# Altium project Ninja_ECU.PrjPcb
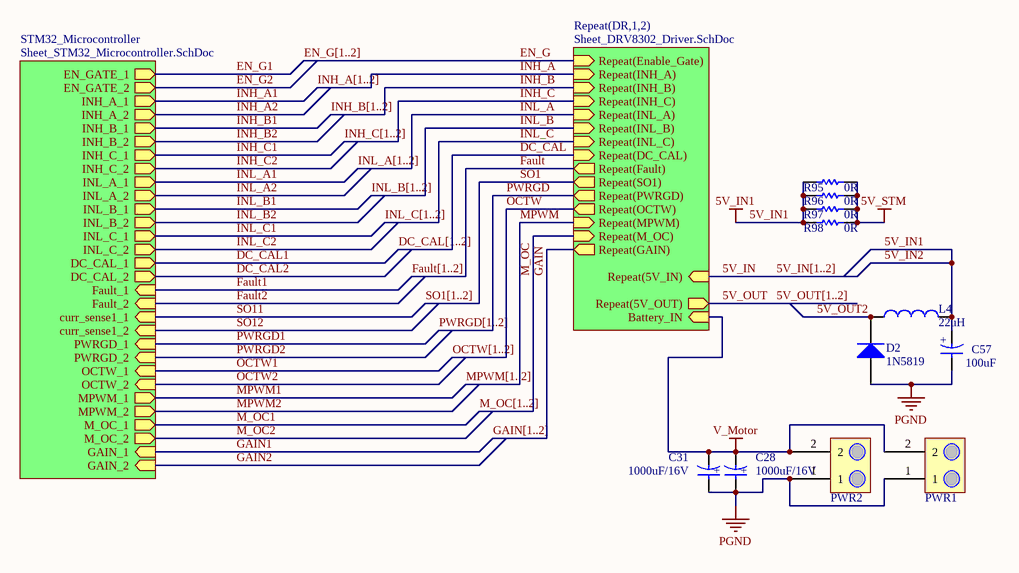
[diagram p0: Sheet_Ninja_ECU.SchDoc]
5 sheets, 317 parts. Net scope: hierarchical (ports join the sheet entries above them; power ports are global).
Board file: Ninja_ECU_PCB.PcbDoc
Sheets:
  Sheet_Ninja_ECU.SchDoc
    STM32_Microcontroller = Sheet_STM32_Microcontroller.SchDoc
      FT4232_USB = Sheet_FT4232_USB.SchDoc
    DR1 = Sheet_DRV8302_Driver.SchDoc
      IRFS_Bridges = Sheet_IRFS7530_bridges.SchDoc
    DR2 = Sheet_DRV8302_Driver.SchDoc
      IRFS_Bridges = Sheet_IRFS7530_bridges.SchDoc

## Sheet Sheet_Ninja_ECU.SchDoc
size A

### Parts
(Parts that share a designator on the sheet are numbered #1, #2 ... from top to bottom, then left to right.)
C28#1  1000uF/16V  [UUG_Series_Cap]
C31#1  1000uF/16V  [UUG_Series_Cap]
C57#1  100uF  [UWT_Series_Cap]
D2#1  1N5819  [DIODE-3]
L4#1  22uH  [SDR0805]
PWR1  Computer Power  [TERM2]  (value not drawn)
PWR2  Battery Power  [TERM2]  (value not drawn)
R95  0R  [2012[0805]]
R96  0R  [2012[0805]]
R97  0R  [2012[0805]]
R98  0R  [2012[0805]]

### Sub-sheets
Repeat(DR,1,2) = Sheet_DRV8302_Driver.SchDoc: Repeat(INH_A) (in), Repeat(Enable_Gate) (in), Repeat(DC_CAL) (in), Repeat(GAIN) (out), Repeat(M_OC) (in), Repeat(MPWM) (in), Repeat(PWRGD) (out), Repeat(SO1) (out), Repeat(OCTW) (out), Repeat(Fault) (out), Repeat(INL_C) (in), Repeat(INH_C) (in), Repeat(INL_B) (in), Repeat(INH_B) (in), Repeat(INL_A) (in), Repeat(5V_OUT) (out), Repeat(5V_IN) (in), Battery_IN (in)
STM32_Microcontroller = Sheet_STM32_Microcontroller.SchDoc: OCTW_1 (in), PWRGD_1 (in), Fault_1 (in), MPWM_1 (out), M_OC_1 (out), GAIN_1 (in), DC_CAL_1 (out), curr_sense1_1 (in), EN_GATE_1 (out), INH_A_1 (out), INL_A_1 (out), INH_C_1 (out), INL_C_1 (out), INH_B_1 (out), INL_B_1 (out), INH_A_2 (out), INL_A_2 (out), EN_GATE_2 (out), INH_B_2 (out), INL_B_2 (out), INH_C_2 (out), INL_C_2 (out), MPWM_2 (out), M_OC_2 (out), GAIN_2 (in), DC_CAL_2 (out), Fault_2 (in), curr_sense1_2 (in), OCTW_2 (in), PWRGD_2 (in)

### Nets
5V_IN1: C57#1.2 L4#1.2 R95.1 R96.1 R97.1 R98.1  [also labelled 5V_IN2]
5V_STM: R95.2 R96.2 R97.2 R98.2  [project net 5V_IRFS]
PGND: C28#1.1 C31#1.1 C57#1.1 D2#1.1(A) PWR1.1 PWR2.1  [project net GND_STM]
V_Motor: C28#1.2 C31#1.2 PWR1.2 PWR2.2 ; sheet Repeat(DR,1,2)/Battery_IN
5V_OUT2: D2#1.2(K) L4#1.1

### Buses and harness runs
bus 5V_IN[1..2]
bus 5V_OUT[1..2]
bus DC_CAL[1..2]
bus EN_G[1..2]
bus Fault[1..2]
bus GAIN[1..2]
bus INH_A[1..2]
bus INH_B[1..2]
bus INH_C[1..2]
bus INL_A[1..2]
bus INL_B[1..2]
bus INL_C[1..2]
bus M_OC[1..2]
bus MPWM[1..2]
bus OCTW[1..2]
bus PWRGD[1..2]
bus SO1[1..2]

### Notes on the sheet
- (in symbol Cap_E) +

### Library data of the parts
C28#1 C31#1 C57#1 = Cap_E: Capacitor; Supplier 1: Digi-Key
  C28 C31: Value: 1000uF/16V; Supplier Part Number 1: 493-7429-1-ND
  C57: Value: 100uF; Supplier Part Number 1: 493-2203-1-ND
D2#1 = Diode: Value: ?; Supplier 1: Digi-Key; Supplier Part Number 1: 1N5819HW-FDICT-ND
L4#1 = Inductor: Value: 22uH; Supplier 1: Digi-Key; Supplier Part Number 1: SDR0805-220MLCT-ND
PWR1 PWR2 = Terminal2: Connector; Value: ?
R95-R98 = Res: Value: 0R; Supplier 1: Digi-Key; Supplier Part Number 1: 311-0.0ARCT-ND

## Sheet Sheet_STM32_Microcontroller.SchDoc
size 419 x 304 mm
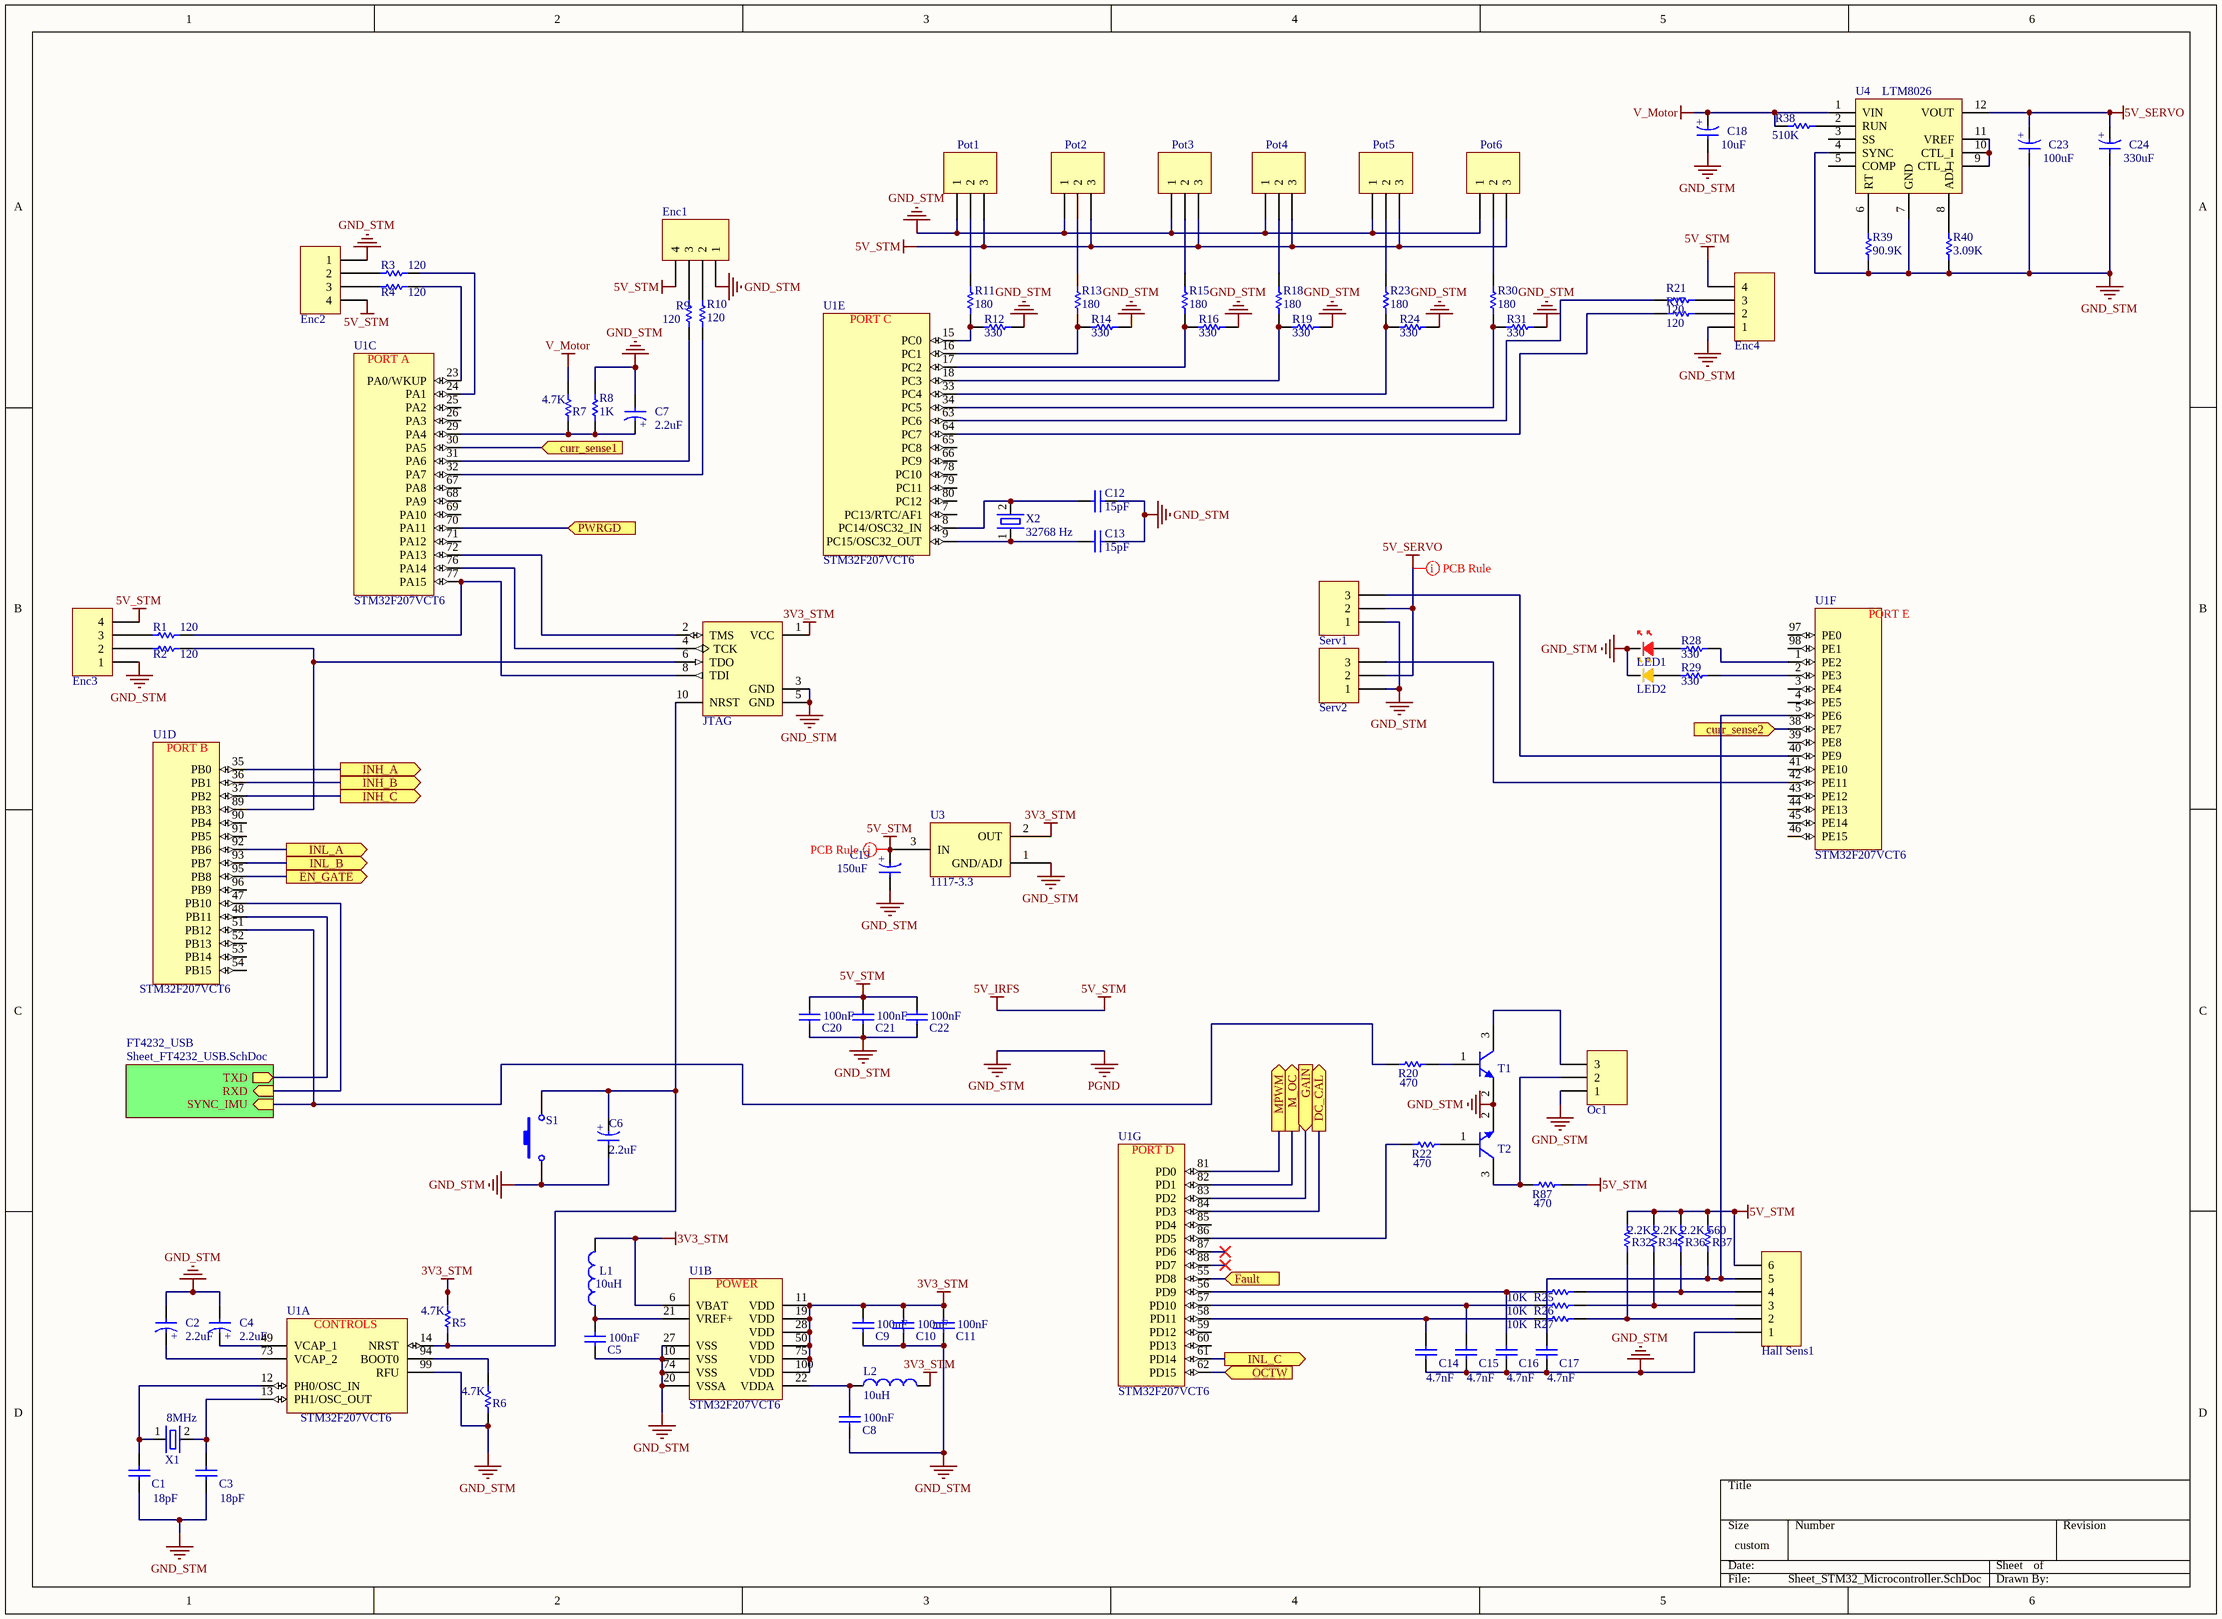
[diagram p1: Sheet_STM32_Microcontroller.SchDoc]

### Parts
C1  18pF  [1608[0603]]
C2  2.2uF  [1608[0603] - Polar]
C3  18pF  [1608[0603]]
C4  2.2uF  [1608[0603] - Polar]
C5  100nF  [1608[0603]]
C6  2.2uF  [1608[0603] - Polar]
C7  2.2uF  [1608[0603] - Polar]
C8  100nF  [1608[0603]]
C9  100nF  [1608[0603]]
C10  100nF  [1608[0603]]
C11  100nF  [1608[0603]]
C12  15pF  [1608[0603]]
C13  15pF  [1608[0603]]
C14  4.7nF  [1608[0603]]
C15  4.7nF  [1608[0603]]
C16  4.7nF  [1608[0603]]
C17  4.7nF  [1608[0603]]
C18  10uF  [6032 [2312]]
C19  150uF  [6032 [2312]]
C20  100nF  [1608[0603]]
C21  100nF  [1608[0603]]
C22  100nF  [1608[0603]]
C23  100uF  [6032 [2312]]
C24  330uF  [6032 [2312]]
H1  Enc3  [Header 4  -MolexPicoBlade]
H2  Enc2  [Header 4  -MolexPicoBlade]
H3  Enc1  [Header 4  -MolexPicoBlade]
H4  JTAG  [HDR-2*5-0.05_Without_Through_Hole]
H5  Serv1  [HDR1X3]
H7  Pot1  [Header 3  -MolexPicoBlade]
H8  Pot2  [Header 3  -MolexPicoBlade]
H9  Pot3  [Header 3  -MolexPicoBlade]
H10  Pot4  [Header 3  -MolexPicoBlade]
H11  Enc4  [Header 4  -MolexPicoBlade]
H12  Pot5  [Header 3  -MolexPicoBlade]
H13  Serv2  [HDR1X3]
H16  Pot6  [Header 3  -MolexPicoBlade]
H17  Oc1  [Header 3  -MolexPicoBlade]
H18  Hall Sens1  [Header 6  ZH-SM4]
L1  10uH  [0805]
L2  10uH  [0805]
LED1  LEDR  [2012[0805]]  (value not drawn)
LED2  LEDY  [2012[0805]]  (value not drawn)
R1  120  [1608[0603]]
R2  120  [1608[0603]]
R3  120  [1608[0603]]
R4  120  [1608[0603]]
R5  4.7K  [1608[0603]]
R6  4.7K  [1608[0603]]
R7  4.7K  [1608[0603]]
R8  1K  [1608[0603]]
R9  120  [1608[0603]]
R10  120  [1608[0603]]
R11  180  [1608[0603]]
R12  330  [1608[0603]]
R13  180  [1608[0603]]
R14  330  [1608[0603]]
R15  180  [1608[0603]]
R16  330  [1608[0603]]
R17  120  [1608[0603]]
R18  180  [1608[0603]]
R19  330  [1608[0603]]
R20  470  [1608[0603]]
R21  120  [1608[0603]]
R22  470  [1608[0603]]
R23  180  [1608[0603]]
R24  330  [1608[0603]]
R25  10K  [1608[0603]]
R26  10K  [1608[0603]]
R27  10K  [1608[0603]]
R28  330  [1608[0603]]
R29  330  [1608[0603]]
R30  180  [1608[0603]]
R31  330  [1608[0603]]
R32  2.2K  [1608[0603]]
R34  2.2K  [1608[0603]]
R36  2.2K  [1608[0603]]
R37  560  [1608[0603]]
R38  510K  [1608[0603]]
R39  90.9K  [1608[0603]]
R40  3.09K  [1608[0603]]
R87  470  [1608[0603]]
S1  SW_TACT  [PTS645SH50SMTR92_LFS]  (value not drawn)
T1  BC817  [SOT-23]  (value not drawn)
T2  BC817  [SOT-23]  (value not drawn)
U1  STM32F207VCT6  [LQFP100_M]  (parts A,B,C,D,E,F,G of 7)
U3  1117-3.3  [SOT-223]
U4  LTM8026  [LGA_Package]
X1  8MHz  [ABM7]
X2  32768 Hz  [0805]

### Sub-sheets
FT4232_USB = Sheet_FT4232_USB.SchDoc: RXD (in), SYNC_IMU (in), TXD (out)

### Ports
curr_sense1 (in), curr_sense2 (in), DC_CAL (out), EN_GATE (out), Fault (in), GAIN (in), INH_A (out), INH_B (out), INH_C (out), INL_A (out), INL_B (out), INL_C (out), M_OC (out), MPWM (out), OCTW (in), PWRGD (in)

### Nets
3V3_STM: C9.2 C10.2 C11.2 H4.1(VCC) L1.2 L2.2 R5.2 U1.6(VBAT) U1.11(VDD) U1.19(VDD) U1.28(VDD) U1.50(VDD) U1.75(VDD) U1.100(VDD) U3.2(OUT)
5V_IRFS: C19.2 C20.2 C21.2 C22.2 H1.4 H2.4 H3.4 H7.3 H8.3 H9.3 H10.3 H11.4 H12.3 H16.3 H18.6 R32.2 R34.2 R36.2 R37.2 R87.1 U3.3(IN)  [also labelled 5V_STM]
5V_SERVO: C23.2 C24.2 H5.2 H13.2 U4.12(VOUT)
GND_STM: C1.1 C2.1 C3.1 C4.1 C5.1 C6.1 C7.1 C8.1 C9.1 C10.1 C11.1 C12.2 C13.2 C14.1 C15.1 C16.1 C17.1 C18.1 C19.1 C20.1 C21.1 C22.1 C23.1 C24.1 H1.1 H2.1 H3.1 H4.3(GND) H4.5(GND) H5.1 H7.1 H8.1 H9.1 H10.1 H11.1 H12.1 H13.1 H16.1 H17.1 H18.1 LED1.2(K) LED2.2(K) R6.1 R8.2 R12.2 R14.2 R16.2 R19.2 R24.2 R31.2 R39.1 R40.1 S1.1 T1.2(E) T2.2(E) U1.10(VSS) U1.20(VSSA) U1.27(VSS) U1.74(VSS) U1.99(RFU) U3.1(GND/ADJ) U4.4(SYNC) U4.7(GND)  [also labelled PGND]
V_Motor: C18.2 R7.2 R38.1 U4.1(VIN)
NetC1_2: C1.2 U1.12(PH0/OSC_IN) X1.1(OSC1)
NetC2_2: C2.2 U1.73(VCAP_2)
NetC3_2: C3.2 U1.13(PH1/OSC_OUT) X1.2(OSC2)
NetC4_2: C4.2 U1.49(VCAP_1)
NetC5_2: C5.2 L1.1 U1.21(VREF+)
NetC6_2: C6.2 H4.10(NRST) R5.1 S1.2 U1.14(NRST)
NetC7_2: C7.2 R7.1 R8.1 U1.29(PA4)
NetC8_2: C8.2 L2.1 U1.22(VDDA)
NetC12_1: C12.1 U1.8(PC14/OSC32_IN) X2.2(OSC2)
NetC13_1: C13.1 U1.9(PC15/OSC32_OUT) X2.1(OSC1)
NetC14_2: C14.2 R27.1 U1.58(PD11)
NetC15_2: C15.2 R26.1 U1.57(PD10)
NetC16_2: C16.2 R25.1 U1.56(PD9)
NetC17_2: C17.2 H18.5 R37.1 U1.5(PE6)
NetH1_2: H1.2 R2.1
NetH1_3: H1.3 R1.1
NetH2_2: H2.2 R3.1
NetH2_3: H2.3 R4.1
NetH3_2: H3.2 R10.1
NetH3_3: H3.3 R9.1
NetH4_2: H4.2(TMS) U1.72(PA13)
NetH4_4: H4.4(TCK) U1.76(PA14)
NetH4_6: H4.6(TDO) R2.2 U1.89(PB3)
NetH4_8: H4.8(TDI) R1.2 U1.77(PA15)
NetH5_3: H5.3 U1.40(PE9)
NetH7_2: H7.2 R11.2
NetH8_2: H8.2 R13.2
NetH9_2: H9.2 R15.2
NetH10_2: H10.2 R18.2
NetH11_2: H11.2 R17.1
NetH11_3: H11.3 R21.1
NetH12_2: H12.2 R23.2
NetH13_3: H13.3 U1.42(PE11)
NetH16_2: H16.2 R30.2
NetH17_2: H17.2 R87.2 T2.3(C)
NetH17_3: H17.3 T1.3(C)
NetH18_2: H18.2 R27.2 R32.1
NetH18_3: H18.3 R26.2 R34.1
NetH18_4: H18.4 R25.2 R36.1
NetH21_5: R20.2 U1.51(PB12) ; sheet FT4232_USB/SYNC_IMU
NetLED1_1: LED1.1(A) R28.1
NetLED2_1: LED2.1(A) R29.1
NetR3_2: R3.2 U1.24(PA1)
NetR4_2: R4.2 U1.23(PA0/WKUP)
NetR6_2: R6.2 U1.94(BOOT0)
NetR9_2: R9.2 U1.31(PA6)
NetR10_2: R10.2 U1.32(PA7)
NetR11_1: R11.1 R12.1 U1.15(PC0)
NetR13_1: R13.1 R14.1 U1.16(PC1)
NetR15_1: R15.1 R16.1 U1.17(PC2)
NetR17_2: R17.2 U1.64(PC7)
NetR18_1: R18.1 R19.1 U1.18(PC3)
NetR20_1: R20.1 T1.1(B)
NetR21_2: R21.2 U1.63(PC6)
NetR22_1: R22.1 T2.1(B)
NetR22_2: R22.2 U1.86(PD5)
NetR23_1: R23.1 R24.1 U1.33(PC4)
NetR28_2: R28.2 U1.1(PE2)
NetR29_2: R29.2 U1.2(PE3)
NetR30_1: R30.1 R31.1 U1.34(PC5)
NetR38_2: R38.2 U4.2(RUN)
NetR39_2: R39.2 U4.6(RT)
NetR40_2: R40.2 U4.8(ADJ)
NetU1_30: U1.30(PA5) ; port curr_sense1
NetU1_35: U1.35(PB0) ; port INH_A
NetU1_36: U1.36(PB1) ; port INH_B
NetU1_37: U1.37(PB2) ; port INH_C
NetU1_38: U1.38(PE7) ; port curr_sense2
NetU1_47: U1.47(PB10) ; sheet FT4232_USB/RXD
NetU1_48: U1.48(PB11) ; sheet FT4232_USB/TXD
NetU1_55: U1.55(PD8) ; port Fault
NetU1_61: U1.61(PD14) ; port INL_C
NetU1_62: U1.62(PD15) ; port OCTW
NetU1_70: U1.70(PA11) ; port PWRGD
NetU1_81: U1.81(PD0) ; port MPWM
NetU1_82: U1.82(PD1) ; port M_OC
NetU1_83: U1.83(PD2) ; port GAIN
NetU1_84: U1.84(PD3) ; port DC_CAL
NetU1_92: U1.92(PB6) ; port INL_A
NetU1_93: U1.93(PB7) ; port INL_B
NetU1_95: U1.95(PB8) ; port EN_GATE
NetU4_9: U4.9(CTL_T) U4.10(CTL_I) U4.11(VREF)

Not connected (* = marked no-connect by the designer): U1 3(PE4) 4(PE5) 7(PC13/RTC/AF1) 25(PA2) 26(PA3) 39(PE8) 41(PE10) 43(PE12) 44(PE13) 45(PE14) 46(PE15) 52(PB13) 53(PB14) 54(PB15) 59(PD12) 60(PD13) 65(PC8) 66(PC9) 67(PA8) 68(PA9) 69(PA10) 71(PA12) 78(PC10) 79(PC11) 80(PC12) 85(PD4) 87(PD6)* 88(PD7)* 90(PB4) 91(PB5) 96(PB9) 97(PE0) 98(PE1); U4 3(SS) 5(COMP)

### Layout directives
rule Width Constraint [Pref Width = 27.559mil    Min Width = 19.685mil    Max Width = 39.37mil]: 5V_IRFS, 5V_SERVO

### Notes on the sheet
- (in symbol Cap_E) +
- (in symbol STM32F207VCT6, part A) CONTROLS
- (in symbol STM32F207VCT6, part B) POWER
- (in symbol STM32F207VCT6, part C) PORT A
- (in symbol STM32F207VCT6, part D) PORT B
- (in symbol STM32F207VCT6, part E) PORT C
- (in symbol STM32F207VCT6, part F) PORT E
- (in symbol STM32F207VCT6, part G) PORT D

### Library data of the parts
C1 C3 C5 C8-C17 C20-C22 = Cap_BP: Capacitor; Supplier 1: Digi-Key
  C1 C3: Value: 18pF; Supplier Part Number 1: 712-1321-1-ND
  C5 C8-C11 C20-C22: Value: 100nF; Supplier Part Number 1: 311-1088-1-ND
  C12 C13: Value: 15pF; Supplier Part Number 1: 712-1318-1-ND
  C14-C17: Value: 4.7nF; Supplier Part Number 1: 445-2712-1-ND
C2 C4 C6 C7 C18 C19 C23 C24 = Cap_E: Capacitor; Supplier 1: Digi-Key
  C2 C4 C6 C7: Value: 2.2uF; Supplier Part Number 1: 478-8647-1-ND
  C18: Value: 10uF; Supplier Part Number 1: 478-7582-6-ND
  C19: Value: 150uF; Supplier Part Number 1: 478-3481-1-ND
  C23: Value: 100uF; Supplier Part Number 1: 478-1824-1-ND
  C24: Value: 330uF; Supplier Part Number 1: 478-8902-1-ND
H1-H3 H11 = Header 4: Supplier 1: Digi-Key; Supplier Part Number 1: WM7608CT-ND
H4 = JTAG-ARM: USB JTAG Programmer; Supplier 1: Digi-Key; Supplier Part Number 1: 609-3695-1-ND
H5 H13 = Header 3: Header, 3-Pin; LatestRevisionDate: 17-Jul-2002; LatestRevisionNote: Re-released for DXP Platform.; Publisher: Altium Limited
H7-H10 H12 H16 H17 = Header 3: Supplier 1: Digi-Key; Supplier Part Number 1: WM7607CT-ND
H18 = Header 6: Supplier 1: Digi-Key; Supplier Part Number 1: 455-1685-1-ND
L1 L2 = Inductor: Value: 10uH; Supplier 1: Digi-Key; Supplier Part Number 1: 587-2045-1-ND
LED1 = LED_R: LED; Value: ?; Supplier 1: Digi-Key; Supplier Part Number 1: 475-1278-1-ND
LED2 = LED_Y: LED; Value: ?; Supplier 1: Digi-Key; Supplier Part Number 1: 475-2560-1-ND
R1-R32 R34 R36-R40 R87 = Res: Supplier 1: Digi-Key
  R1-R4 R9 R10 R17 R21: Value: 120; Supplier Part Number 1: RMCF0603JT120RCT-ND
  R5-R7: Value: 4.7K; Supplier Part Number 1: P4.7KGCT-ND
  R8: Value: 1K; Supplier Part Number 1: P1.0KGCT-ND
  R11 R13 R15 R18 R23 R30: Value: 180; Supplier Part Number 1: RMCF0603JT180RCT-ND
  R12 R14 R16 R19 R24 R28 R29 R31: Value: 330; Supplier Part Number 1: 311-330GRCT-ND
  R20 R22 R87: Value: 470; Supplier Part Number 1: 311-470GRCT-ND
  R25-R27: Value: 10K; Supplier Part Number 1: P10KGCT-ND
  R32 R34 R36: Value: 2.2K; Supplier Part Number 1: RMCF0603JT2K20CT-ND
  R37: Value: 560; Supplier Part Number 1: 311-560HRCT-ND
  R38: Value: 510K; Supplier Part Number 1: P510KHCT-ND
  R39: Value: 90.9K; Supplier Part Number 1: P90.9KHCT-ND
  R40: Value: 3.09K; Supplier Part Number 1: P3.09KHCT-ND
S1 = SW_TACT: Tactile switch; Supplier 1: Digi-Key; Supplier Part Number 1: CKN9085CT-ND
T1 T2 = BC817: NPN SMD Transistor; Supplier 1: Digi-Key; Supplier Part Number 1: BC817-25LT1GOSCT-ND
U1 = STM32F207VCT6: ARM MCU; Supplier 1: Digi-Key; Supplier Part Number 1: 497-11170-ND
U3 = 1117-3.3V: 3.3V Voltage Regulator; Supplier 1: Digi-Key; Supplier Part Number 1: LM1117IMPX-3.3/NOPBCT-ND
X1 X2 = XTAL: Crystal Oscillator; Published: 8-Jun-2000; LatestRevisionDate: 17-Jul-2002; LatestRevisionNote: Re-released for DXP Platform.; PackageReference: R38; Publisher: Altium Limited; Supplier 1: Digi-Key
  X1: Value: 8MHz; Supplier Part Number 1: 535-9831-1-ND
  X2: Value: 32768 Hz; Supplier Part Number 1: 535-12373-1-ND
U4 = LTM8026: Supplier 1: Digi-Key; Supplier Part Number 1: LTM8026EV#PBF-ND

## Sheet Sheet_FT4232_USB.SchDoc
size 330 x 203 mm
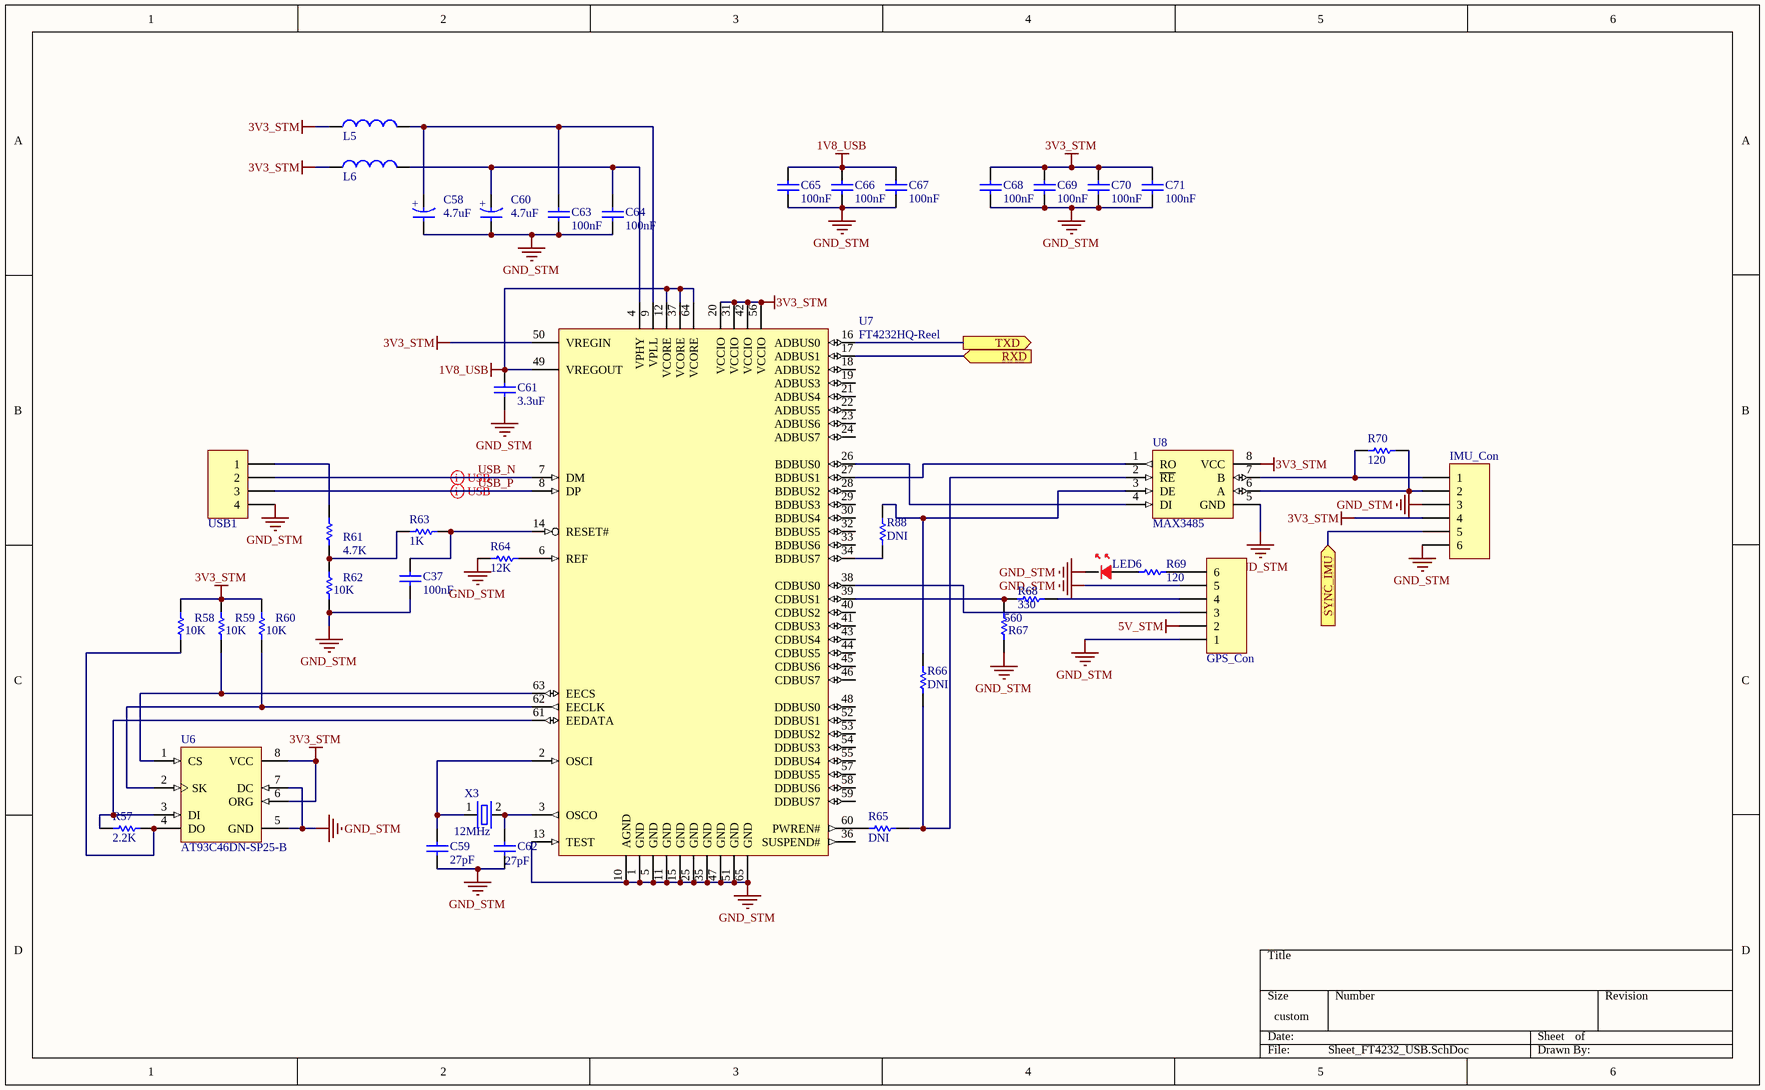
[diagram p2: Sheet_FT4232_USB.SchDoc]

### Parts
C37  100nF  [1608[0603]]
C58  4.7uF  [6032 [2312]]
C59  27pF  [1608[0603]]
C60  4.7uF  [6032 [2312]]
C61  3.3uF  [1608[0603]]
C62  27pF  [1608[0603]]
C63  100nF  [1608[0603]]
C64  100nF  [1608[0603]]
C65  100nF  [1608[0603]]
C66  100nF  [1608[0603]]
C67  100nF  [1608[0603]]
C68  100nF  [1608[0603]]
C69  100nF  [1608[0603]]
C70  100nF  [1608[0603]]
C71  100nF  [1608[0603]]
H19  USB1  [Header 4  -MolexPicoBlade]
H20  GPS_Con  [Header 6  ZH-SM4]
H21  IMU_Con  [Header 6  -MolexPicoBlade]
L5  ?H  [0805]  (value not drawn)
L6  ?H  [0805]  (value not drawn)
LED6  LEDR  [2012[0805]]  (value not drawn)
R57  2.2K  [1608[0603]]
R58  10K  [1608[0603]]
R59  10K  [1608[0603]]
R60  10K  [1608[0603]]
R61  4.7K  [1608[0603]]
R62  10K  [1608[0603]]
R63  1K  [1608[0603]]
R64  12K  [1608[0603]]
R65  DNI  [1608[0603]]
R66  DNI  [1608[0603]]
R67  560  [1608[0603]]
R68  330  [1608[0603]]
R69  120  [1608[0603]]
R70  120  [1608[0603]]
R88  DNI  [1608[0603]]
U6  AT93C46DN-SP25-B  [8S1_M]
U7  FT4232HQ-Reel  [QFN64_2_L_Smaller_Holes]
U8  MAX3485  [SOIC8]
X3  12MHz  [ABM7]

### Ports
RXD (in), SYNC_IMU (in), TXD (out)

### Nets
1V8_USB: C61.1 C65.1 C66.1 C67.1 U7.12(VCORE) U7.37(VCORE) U7.49(VREGOUT) U7.64(VCORE)
3V3_STM: C68.1 C69.1 C70.1 C71.1 H21.4 L5.1 L6.1 R58.2 R59.2 R60.2 U6.6(ORG) U6.8(VCC) U7.20(VCCIO) U7.31(VCCIO) U7.42(VCCIO) U7.50(VREGIN) U7.56(VCCIO) U8.8(VCC)
5V_STM: H20.2  [project net 5V_IRFS]
GND_STM: C37.2 C58.1 C59.2 C60.1 C61.2 C62.2 C63.2 C64.2 C65.2 C66.2 C67.2 C68.2 C69.2 C70.2 C71.2 H19.4 H20.1 H20.5 H21.3 H21.6 LED6.2(K) R62.1 R64.2 R67.1 U6.5(GND) U6.7(DC) U7.1(GND) U7.5(GND) U7.10(AGND) U7.11(GND) U7.13(TEST) U7.15(GND) U7.25(GND) U7.35(GND) U7.47(GND) U7.51(GND) U7.65(GND) U8.5(GND)
USB_N: H19.2 U7.7(DM)
USB_P: H19.3 U7.8(DP)
NetC37_1: C37.1 R63.1 U7.14(RESET#)
NetC58_2: C58.2 C63.1 L5.2 U7.9(VPLL)
NetC59_1: C59.1 U7.2(OSCI) X3.1(OSC1)
NetC60_2: C60.2 C64.1 L6.2 U7.4(VPHY)
NetC62_1: C62.1 U7.3(OSCO) X3.2(OSC2)
NetH19_1: H19.1 R61.2
NetH20_3: H20.3 U7.38(CDBUS0)
NetH20_4: H20.4 R68.2
NetH20_6: H20.6 R69.1
NetH21_1: H21.1 R70.2 U8.7(B)
NetH21_2: H21.2 R70.1 U8.6(A)
NetH21_5: H21.5 ; port SYNC_IMU
NetLED6_1: LED6.1(A) R69.2
NetR57_1: R57.1 R58.1 U6.4(DO)
NetR57_2: R57.2 U6.3(DI) U7.61(EEDATA)
NetR59_1: R59.1 U6.1(CS) U7.63(EECS)
NetR60_1: R60.1 U6.2(SK) U7.62(EECLK)
NetR61_1: R61.1 R62.2 R63.2
NetR64_1: R64.1 U7.6(REF)
NetR65_1: R65.1 U7.60(PWREN#)
NetR65_2: R65.2 R66.2 U8.2(~{RE})
NetR66_1: R66.1 R88.2 U8.3(DE)
NetR67_2: R67.2 R68.1 U7.39(CDBUS1)
NetR88_1: R88.1 U7.34(BDBUS7)
NetU1_47: U7.17(ADBUS1) ; port RXD
NetU1_48: U7.16(ADBUS0) ; port TXD
NetU7_26: U7.26(BDBUS0) U8.4(DI)
NetU7_27: U7.27(BDBUS1) U8.1(RO)

Not connected (* = marked no-connect by the designer): U7 18(ADBUS2) 19(ADBUS3) 21(ADBUS4) 22(ADBUS5) 23(ADBUS6) 24(ADBUS7) 28(BDBUS2) 29(BDBUS3) 30(BDBUS4) 32(BDBUS5) 33(BDBUS6) 36(SUSPEND#) 40(CDBUS2) 41(CDBUS3) 43(CDBUS4) 44(CDBUS5) 45(CDBUS6) 46(CDBUS7) 48(DDBUS0) 52(DDBUS1) 53(DDBUS2) 54(DDBUS3) 55(DDBUS4) 57(DDBUS5) 58(DDBUS6) 59(DDBUS7)

### Layout directives
differential pair: USB_N, USB_P

### Notes on the sheet
- (in symbol Cap_E) +

### Library data of the parts
C37 C59 C61-C71 = Cap_BP: Capacitor; Supplier 1: Digi-Key
  C37 C63-C71: Value: 100nF; Supplier Part Number 1: 311-1088-1-ND
  C59 C62: Value: 27pF; Supplier Part Number 1: 399-7888-1-ND
  C61: Value: 3.3uF; Supplier Part Number 1: 445-5168-1-ND
C58 C60 = Cap_E: Capacitor; Value: 4.7uF; Supplier 1: Digi-Key; Supplier Part Number 1: 478-1717-1-ND
H19 = Header 4: Supplier 1: Digi-Key; Supplier Part Number 1: WM7608CT-ND
H20 H21 = Header 6: Supplier 1: Digi-Key
  H20: Supplier Part Number 1: 455-1685-1-ND
  H21: Supplier Part Number 1: WM7610CT-ND
L5 L6 = Inductor: Value: ?H; Supplier 1: Digi-Key; Supplier Part Number 1: 587-1764-1-ND
LED6 = LED_R: LED; Value: ?; Supplier 1: Digi-Key; Supplier Part Number 1: 475-1278-1-ND
R57-R70 R88 = Res
  R57: Value: 2.2K; Supplier 1: Digi-Key; Supplier Part Number 1: RMCF0603JT2K20CT-ND
  R58-R60 R62: Value: 10K; Supplier 1: Digi-Key; Supplier Part Number 1: P10KGCT-ND
  R61: Value: 4.7K; Supplier 1: Digi-Key; Supplier Part Number 1: P4.7KGCT-ND
  R63: Value: 1K; Supplier 1: Digi-Key; Supplier Part Number 1: P1.0KGCT-ND
  R64: Value: 12K; Supplier 1: Digi-Key; Supplier Part Number 1: 311-12KGRCT-ND
  R65 R66 R88: Value: DNI
  R67: Value: 560; Supplier 1: Digi-Key; Supplier Part Number 1: 311-560HRCT-ND
  R68: Value: 330; Supplier 1: Digi-Key; Supplier Part Number 1: 311-330GRCT-ND
  R69 R70: Value: 120; Supplier 1: Digi-Key; Supplier Part Number 1: RMCF0603JT120RCT-ND
U6 = AT93C46DN-SP25-B: 1Kbit (128 x 8 or 64 x 16), 3-wire Bus Serial Automotive EEPROM, 2.5V, 8-Pin SOIC, Bulk; Published: 20-Sep-2010; DatasheetVersion: 8674B,  Oct-2009; PackageVersion: revC, Mar-2005; PackageReference: 8S1; Publisher: Altium Limited; PackageDescription: 8-Lead (0.150" Wide Body), Plastic Gull Wing Small Outline (JEDEC SOIC); Code_JEDEC: MS-012-AA; Code_IPC: SOIC127P600-8; ComponentLink1Description: Manufacturer Link; ComponentLink1URL: http://www.atmel.com/products/serial/default.asp; ComponentLink2Description: Datasheet; ComponentLink2URL: http://www.atmel.com/dyn/resources/prod_documents/doc8674.pdf; ComponentLink3Description: Atmel.com Home; ComponentLink3URL: http://www.atmel.com; Supplier 1: Digi-Key; Supplier Part Number 1: AT93C46DN-SH-B-ND
U7 = FT4232HQ-Reel: Quad High Speed USB To Multipurpose UART/MPSSE IC, QFN-64, Tape and Reel; Published: 30-Aug-2010; DatasheetVersion: ver 2.08, May-2010; PackageVersion: 2010; PackageReference: QFN64_2; Publisher: Altium Limited; PackageDescription: 64-Pin Quad Flat No-Lead, 9 x 9 mm Body, 0.5 mm Pitch, 4.35 x 4.35 mm Exposed Pad; ComponentLink1Description: Manufacturer Link; ComponentLink1URL: http://www.ftdichip.com/Products/ICs/FT4232H.htm; ComponentLink2Description: Datasheet; ComponentLink2URL: http://www.ftdichip.com/Support/Documents/DataSheets/ICs/DS_FT4232H.pdf; Supplier 1: Digi-Key; Supplier Part Number 1: 768-1027-1-ND
X3 = XTAL: Crystal Oscillator; Published: 8-Jun-2000; LatestRevisionDate: 17-Jul-2002; LatestRevisionNote: Re-released for DXP Platform.; PackageReference: R38; Publisher: Altium Limited; Value: 12MHz; Supplier 1: Digi-Key; Supplier Part Number 1: 535-13457-1-ND
U8 = MAX3485: Supplier 1: Digi-Key; Supplier Part Number 1: MAX3485CSA+-ND

## Sheet Sheet_DRV8302_Driver.SchDoc
size 254 x 228 mm
Used 2 times, as channels DR1, DR2. Parts and nets are listed once, with the designators drawn on the sheet.
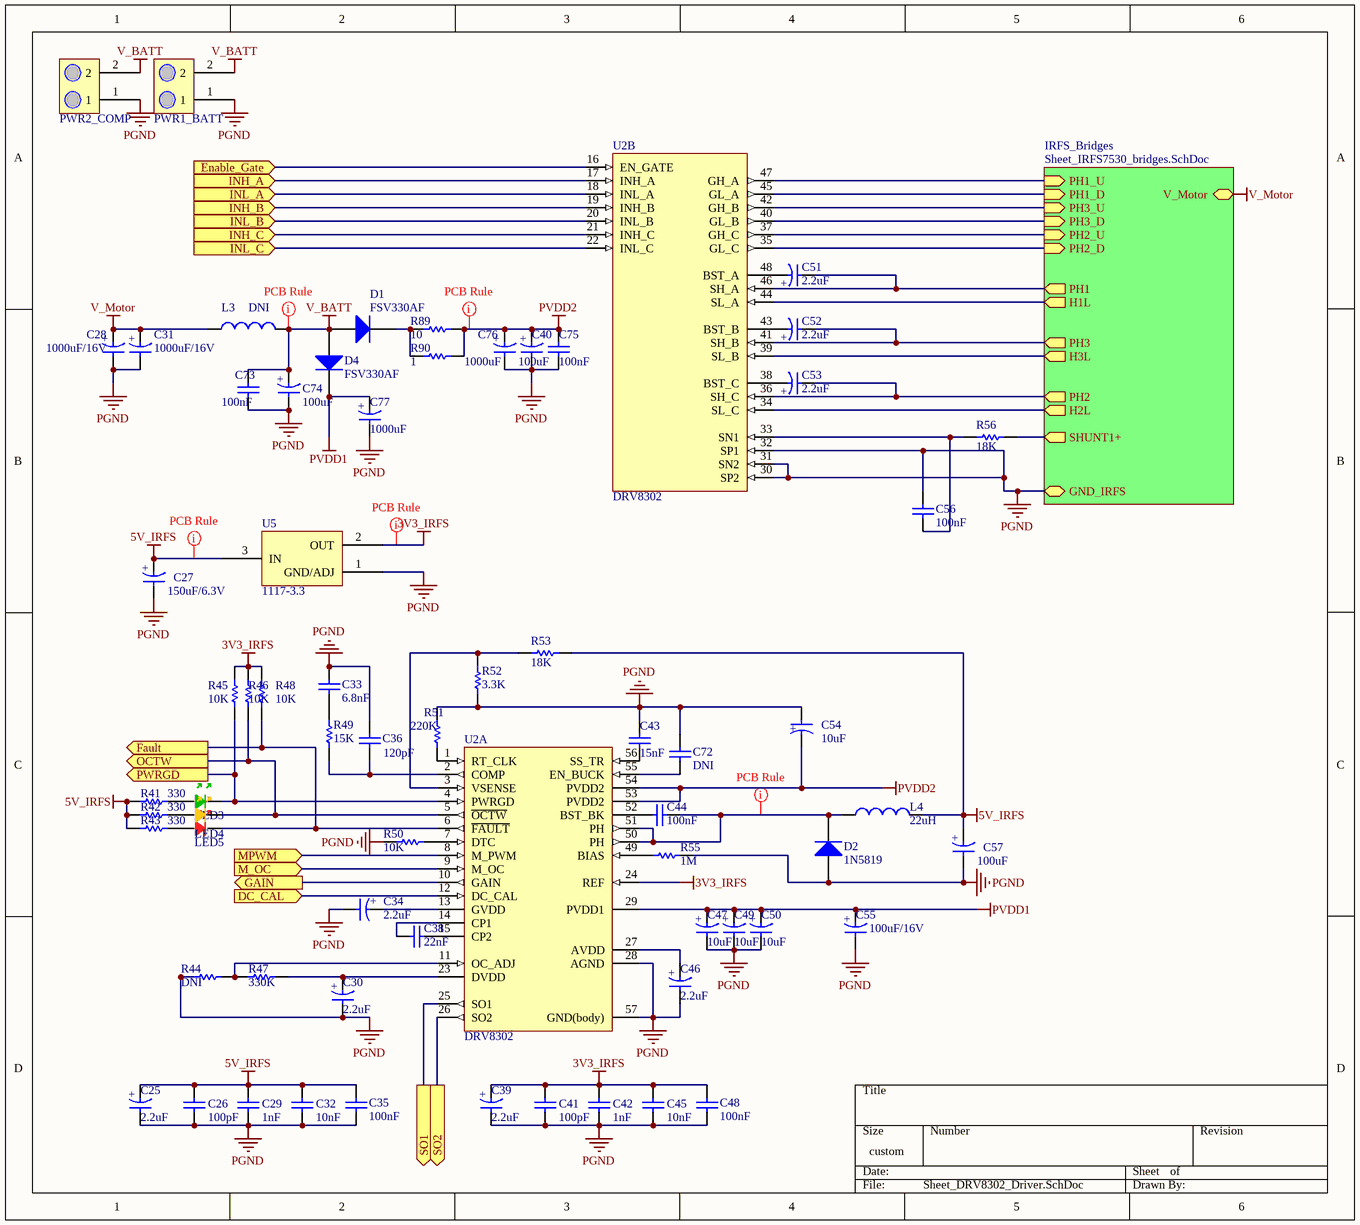
[diagram p3: Sheet_DRV8302_Driver.SchDoc]

### Parts
C25  2.2uF  [1608[0603] - Polar]
C26  100pF  [1608[0603]]
C27  150uF/6.3V  [6032 [2312]]
C28  1000uF/16V  [Large_SMD_Cap]
C29  1nF  [1608[0603]]
C30  2.2uF  [1608[0603] - Polar]
C31  1000uF/16V  [Large_SMD_Cap]
C32  10nF  [1608[0603]]
C33  6.8nF  [1608[0603]]
C34  2.2uF  [1608[0603] - Polar]
C35  100nF  [1608[0603]]
C36  120pF  [1608[0603]]
C38  22nF  [1608[0603]]
C39  2.2uF  [1608[0603] - Polar]
C40  100uF  [6032 [2312]]
C41  100pF  [1608[0603]]
C42  1nF  [1608[0603]]
C43  15nF  [1608[0603]]
C44  100nF  [1608[0603]]
C45  10nF  [1608[0603]]
C46  2.2uF  [1608[0603] - Polar]
C47  10uF  [6032 [2312]]
C48  100nF  [1608[0603]]
C49  10uF  [6032 [2312]]
C50  10uF  [6032 [2312]]
C51  2.2uF  [1608[0603] - Polar]
C52  2.2uF  [1608[0603] - Polar]
C53  2.2uF  [1608[0603] - Polar]
C54  10uF  [6032 [2312]]
C55  100uF/16V  [6032 [2312]]
C56  100nF  [1608[0603]]
C57  100uF  [6032 [2312]]
C72  value DNI  [1608[0603]]  (hidden comment: 1uF)
C73  100nF  [1608[0603]]
C74  100uF  [6032 [2312]]
C75  100nF  [1608[0603]]
C76  1000uF  [Large_SMD_Cap]
C77  1000uF  [Large_SMD_Cap]
D1  FSV330AF  [FSV330AF/FSV340AF]
D2  1N5819  [DIODE-3]
D4  FSV330AF  [FSV330AF/FSV340AF]
L3  DNI  [Toroid]
L4  22uH  [VLC2]
LED3  LEDG  [2012[0805]]  (value not drawn)
LED4  LEDY  [2012[0805]]  (value not drawn)
LED5  LEDR  [2012[0805]]  (value not drawn)
PWR1_BATT  Terminal2  [TERM2]  (value not drawn)
PWR2_COMP  Terminal2  [TERM2]  (value not drawn)
R41  330  [1608[0603]]
R42  330  [1608[0603]]
R43  330  [1608[0603]]
R44  DNI  [1608[0603]]
R45  10K  [1608[0603]]
R46  10K  [1608[0603]]
R47  330K  [1608[0603]]
R48  10K  [1608[0603]]
R49  15K  [1608[0603]]
R50  10K  [1608[0603]]
R51  220K  [1608[0603]]
R52  3.3K  [1608[0603]]
R53  18K  [1608[0603]]
R55  1M  [1608[0603]]
R56  18K  [1608[0603]]
R89  10  [1608[0603]]
R90  1  [2012[0805]]
U2  DRV8302  [DRV8302]  (parts A,B of 2)
U5  1117-3.3  [SOT-223]

### Sub-sheets
IRFS_Bridges = Sheet_IRFS7530_bridges.SchDoc: V_Motor (bidir), GND_IRFS, H1L (out), H2L (out), H3L (out), PH1 (out), PH1_U (in), PH1_D (in), SHUNT1+ (out), PH2_D (in), PH3_D (in), PH2 (out), PH3 (out), PH2_U (in), PH3_U (in)

### Ports
DC_CAL (in), Enable_Gate (in), Fault (out), GAIN (out), INH_A (in), INH_B (in), INH_C (in), INL_A (in), INL_B (in), INL_C (in), M_OC (in), MPWM (in), OCTW (out), PWRGD (out), SO1 (out), SO2 (out)

### Nets
3V3_IRFS: C39.2 C41.2 C42.2 C45.2 C48.1 R45.2 R46.2 R48.2 U2.24(REF) U5.2(OUT)
5V_IRFS: C25.2 C26.2 C27.2 C29.2 C32.2 C35.1 C57.2 L4.2 R41.1 R42.1 R43.1 R53.2 U5.3(IN)
PGND: C25.1 C26.1 C27.1 C28.1 C29.1 C30.1 C31.1 C32.1 C33.1 C34.1 C35.2 C36.1 C39.1 C40.1 C41.1 C42.1 C43.1 C45.1 C46.1 C47.1 C48.2 C49.1 C50.1 C54.1 C55.1 C56.1 C57.1 C72.2 C73.2 C74.1 C75.2 C76.1 C77.1 D2.1(A) PWR1_BATT.1 PWR2_COMP.1 R44.1 R50.1 R51.1 R52.2 R55.2 U2.28(AGND) U2.30(SP2) U2.31(SN2) U2.32(SP1) U2.57(GND(body)) U5.1(GND/ADJ) ; sheet IRFS_Bridges/GND_IRFS
PVDD1: C47.2 C49.2 C50.2 C55.2 C77.2 D4.2(K) U2.29(PVDD1)
PVDD2: C40.2 C54.2 C75.1 C76.2 R89.1 R90.1 U2.53(PVDD2) U2.54(PVDD2)
V_BATT: C73.1 C74.2 D1.1(A) D4.1(A) L3.2 PWR1_BATT.2 PWR2_COMP.2
V_Motor: C28.2 C31.2 L3.1 ; sheet IRFS_Bridges/V_Motor
DC_CAL: U2.12(DC_CAL) ; port DC_CAL
Enable_Gate: U2.16(EN_GATE) ; port Enable_Gate
Fault: LED5.2(K) R48.1 U2.6(~{FAULT}) ; port Fault
GAIN: U2.10(GAIN) ; port GAIN
INH_A: U2.17(INH_A) ; port INH_A
INH_B: U2.19(INH_B) ; port INH_B
INH_C: U2.21(INH_C) ; port INH_C
INL_A: U2.18(INL_A) ; port INL_A
INL_B: U2.20(INL_B) ; port INL_B
INL_C: U2.22(INL_C) ; port INL_C
M_OC: U2.9(M_OC) ; port M_OC
MPWM: U2.8(M_PWM) ; port MPWM
OCTW: LED4.2(K) R46.1 U2.5(~{OCTW}) ; port OCTW
PWRGD: LED3.2(K) R45.1 U2.4(PWRGD) ; port PWRGD
SO1: U2.25(SO1) ; port SO1
SO2: U2.26(SO2) ; port SO2
NetC30_2: C30.2 R47.2 U2.23(DVDD)
NetC33_2: C33.2 R49.2
NetC34_2: C34.2 U2.13(GVDD)
NetC36_2: C36.2 R49.1 U2.2(COMP)
NetC38_1: C38.1 U2.15(CP2)
NetC38_2: C38.2 U2.14(CP1)
NetC43_2: C43.2 U2.56(SS_TR)
NetC44_1: C44.1 U2.52(BST_BK)
NetC44_2: C44.2 D2.2(K) L4.1 U2.50(PH) U2.51(PH)
NetC46_2: C46.2 U2.27(AVDD)
NetC51_1: C51.1 U2.46(SH_A) ; sheet IRFS_Bridges/PH1
NetC51_2: C51.2 U2.48(BST_A)
NetC52_1: C52.1 U2.41(SH_B) ; sheet IRFS_Bridges/PH3
NetC52_2: C52.2 U2.43(BST_B)
NetC53_1: C53.1 U2.36(SH_C) ; sheet IRFS_Bridges/PH2
NetC53_2: C53.2 U2.38(BST_C)
NetC56_2: C56.2 R56.1 U2.33(SN1)
NetC72_1: C72.1 U2.55(EN_BUCK)
NetD1_2: D1.2(K) R89.2 R90.2
NetLED3_1: LED3.1(A) R41.2
NetLED4_1: LED4.1(A) R42.2
NetLED5_1: LED5.1(A) R43.2
NetR44_2: R44.2 R47.1 U2.11(OC_ADJ)
NetR50_2: R50.2 U2.7(DTC)
NetR51_2: R51.2 U2.1(RT_CLK)
NetR52_1: R52.1 R53.1 U2.3(VSENSE)
NetR55_1: R55.1 U2.49(BIAS)
NetR56_2: R56.2 ; sheet IRFS_Bridges/SHUNT1+
NetU2_34: U2.34(SL_C) ; sheet IRFS_Bridges/H2L
NetU2_35: U2.35(GL_C) ; sheet IRFS_Bridges/PH2_D
NetU2_37: U2.37(GH_C) ; sheet IRFS_Bridges/PH2_U
NetU2_39: U2.39(SL_B) ; sheet IRFS_Bridges/H3L
NetU2_40: U2.40(GL_B) ; sheet IRFS_Bridges/PH3_D
NetU2_42: U2.42(GH_B) ; sheet IRFS_Bridges/PH3_U
NetU2_44: U2.44(SL_A) ; sheet IRFS_Bridges/H1L
NetU2_45: U2.45(GL_A) ; sheet IRFS_Bridges/PH1_D
NetU2_47: U2.47(GH_A) ; sheet IRFS_Bridges/PH1_U

### Channels
DR1: designators C25=C25 C26=C26 C27=C27 C28=C28#2 C29=C29 C30=C30 C31=C31#2 C32=C32 C33=C33 C34=C34 C35=C35 C36=C36 C38=C38 C39=C39 C40=C40 C41=C41 C42=C42 C43=C43 C44=C44 C45=C45 C46=C46 C47=C47 C48=C48 C49=C49 C50=C50 C51=C51 C52=C52 C53=C53 C54=C54 C55=C55 C56=C56 C57=C57#2 C72=C72 C73=C73 C74=C74 C75=C75 C76=C76 C77=C77 D1=D1 D2=D2#2 D4=D4 L3=L3 L4=L4#2 LED3=LED3 LED4=LED4 LED5=LED5 PWR1_BATT=PWR1_BATT_DR1 PWR2_COMP=PWR2_COMP_DR1 R41=R41 R42=R42 R43=R43 R44=R44 R45=R45 R46=R46 R47=R47 R48=R48 R49=R49 R50=R50 R51=R51 R52=R52 R53=R53 R55=R55 R56=R56 R89=R89 R90=R90 U2=U2 U5=U5; ports DC_CAL=DC_CAL1 Enable_Gate=EN_G1 Fault=Fault1 GAIN=GAIN1 INH_A=INH_A1 INH_B=INH_B1 INH_C=INH_C1 INL_A=INL_A1 INL_B=INL_B1 INL_C=INL_C1 M_OC=M_OC1 MPWM=MPWM1 OCTW=OCTW1 PWRGD=PWRGD1 SO1=SO11 SO2=NetU2_26
DR2: designators end in _DR2; ports DC_CAL=DC_CAL2 Enable_Gate=EN_G2 Fault=Fault2 GAIN=GAIN2 INH_A=INH_A2 INH_B=INH_B2 INH_C=INH_C2 INL_A=INL_A2 INL_B=INL_B2 INL_C=INL_C2 M_OC=M_OC2 MPWM=MPWM2 OCTW=OCTW2 PWRGD=PWRGD2 SO1=SO12 SO2=NetU2_DR2_26

### Layout directives
rule Width Constraint [Pref Width = 27.559mil    Min Width = 19.685mil    Max Width = 39.37mil]: 3V3_IRFS, 5V_IRFS, NetC44_2, PVDD2
rule Width Constraint [Pref Width = 27.559mil    Min Width = 19.685mil    Max Width = 196.85mil]: V_BATT

### Notes on the sheet
- (in symbol Cap_E) +

### Library data of the parts
C25 C27 C28 C30 C31 C34 C39 C40 C46 C47 C49-C55 C57 C74 C76 C77 = Cap_E: Capacitor; Supplier 1: Digi-Key
  C25 C30 C34 C39 C46 C51-C53: Value: 2.2uF; Supplier Part Number 1: 478-8647-1-ND
  C27: Value: 150uF/6.3V; Supplier Part Number 1: 478-3481-1-ND
  C28 C31: Value: 1000uF/16V; Supplier Part Number 1: 493-3930-1-ND
  C40 C74: Value: 100uF; Supplier Part Number 1: 478-5258-1-ND
  C47 C49 C50 C54: Value: 10uF; Supplier Part Number 1: 478-1702-1-ND
  C55: Value: 100uF/16V; Supplier Part Number 1: 478-5258-1-ND
  C57: Value: 100uF; Supplier Part Number 1: 478-7995-1-ND
  C76 C77: Value: 1000uF; Supplier Part Number 1: 493-3930-1-ND
C26 C29 C32 C33 C35 C36 C38 C41-C45 C48 C56 C72 C73 C75 = Cap_BP: Capacitor; Supplier 1: Digi-Key
  C26 C41: Value: 100pF; Supplier Part Number 1: 399-1061-1-ND
  C29 C42: Value: 1nF; Supplier Part Number 1: 490-1494-1-ND
  C32 C45: Value: 10nF; Supplier Part Number 1: 311-1085-1-ND
  C33: Value: 6.8nF; Supplier Part Number 1: 445-2667-1-ND
  C35 C44 C48 C56 C75: Value: 100nF; Supplier Part Number 1: 311-1088-1-ND
  C36: Value: 120pF; Supplier Part Number 1: 399-1062-1-ND
  C38: Value: 22nF; Supplier Part Number 1: 399-3476-1-ND
  C43: Value: 15nF; Supplier Part Number 1: 399-10044-1-ND
  C72: Supplier Part Number 1: 478-8658-1-ND
  C73: Value: 100nF; Supplier Part Number 1: 311-1343-1-ND
D1 D2 D4 = Diode: Value: ?; Supplier 1: Digi-Key
  D1 D4: Supplier Part Number 1: FSV330AFCT-ND
  D2: Supplier Part Number 1: 1N5819HW-FDICT-ND
L3 L4 = Inductor: Supplier 1: Digi-Key
  L3: Value: DNI; Supplier Part Number 1: SDR0805-101KLCT-ND
  L4: Value: 22uH; Supplier Part Number 1: SDR0805-220MLCT-ND
LED3 = LED_G: LED; Value: ?; Supplier 1: Digi-Key; Supplier Part Number 1: 475-1410-1-ND
LED4 = LED_Y: LED; Value: ?; Supplier 1: Digi-Key; Supplier Part Number 1: 475-2560-1-ND
LED5 = LED_R: LED; Value: ?; Supplier 1: Digi-Key; Supplier Part Number 1: 475-1278-1-ND
PWR1_BATT PWR2_COMP = Terminal2: Connector; Value: ?
R41-R53 R55 R56 R89 R90 = Res: Supplier 1: Digi-Key
  R41-R43: Value: 330; Supplier Part Number 1: 311-330GRCT-ND
  R44: Value: DNI; Supplier Part Number 1: P10KGCT-ND
  R45 R46 R48 R50: Value: 10K; Supplier Part Number 1: P10KGCT-ND
  R47: Value: 330K; Supplier Part Number 1: P330KGCT-ND
  R49: Value: 15K; Supplier Part Number 1: RMCF0603JT15K0CT-ND
  R51: Value: 220K; Supplier Part Number 1: P220KGCT-ND
  R52: Value: 3.3K; Supplier Part Number 1: RMCF0603JT3K30CT-ND
  R53 R56: Value: 18K; Supplier Part Number 1: RMCF0603JT18K0CT-ND
  R55: Value: 1M; Supplier Part Number 1: P1.00MHCT-ND
  R89: Value: 10; Supplier Part Number 1: 311-10.0CRCT-ND
  R90: Value: 1; Supplier Part Number 1: RMCF0805JT1R00CT-ND
U5 = 1117-3.3V: 3.3V Voltage Regulator; Supplier 1: Digi-Key; Supplier Part Number 1: LM1117IMPX-3.3/NOPBCT-ND
U2 = DRV8302: Supplier 1: Digi-Key; Supplier Part Number 1: 296-29544-6-ND

## Sheet Sheet_IRFS7530_bridges.SchDoc
size A
Used 2 times, as channels DR1/IRFS_Bridges, DR2/IRFS_Bridges. Parts and nets are listed once, with the designators drawn on the sheet.
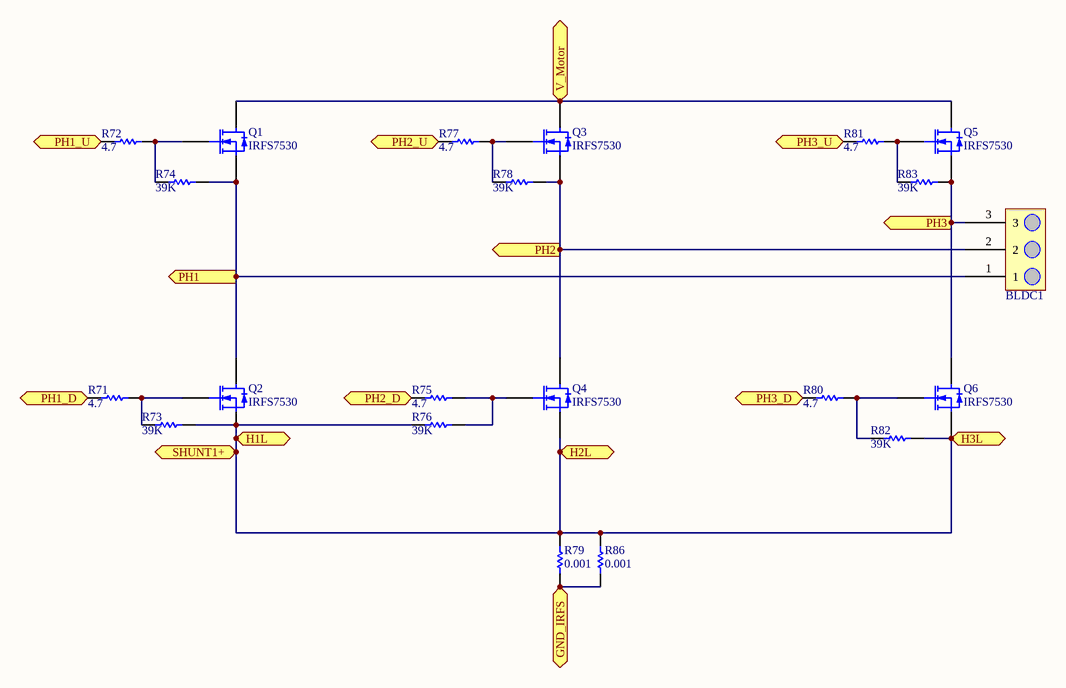
[diagram p4: Sheet_IRFS7530_bridges.SchDoc]

### Parts
BLDC1  Terminal3  [TERM3]  (value not drawn)
Q1  IRFS7530  [D2PAK-7Pin]
Q2  IRFS7530  [D2PAK-7Pin]
Q3  IRFS7530  [D2PAK-7Pin]
Q4  IRFS7530  [D2PAK-7Pin]
Q5  IRFS7530  [D2PAK-7Pin]
Q6  IRFS7530  [D2PAK-7Pin]
R71  4.7  [1608[0603]]
R72  4.7  [1608[0603]]
R73  39K  [1608[0603]]
R74  39K  [1608[0603]]
R75  4.7  [1608[0603]]
R76  39K  [1608[0603]]
R77  4.7  [1608[0603]]
R78  39K  [1608[0603]]
R79  0.001  [5931]
R80  4.7  [1608[0603]]
R81  4.7  [1608[0603]]
R82  39K  [1608[0603]]
R83  39K  [1608[0603]]
R86  0.001  [5931]

### Ports
GND_IRFS (bidir), H1L (out), H2L (out), H3L (out), PH1 (out), PH1_D (in), PH1_U (in), PH2 (out), PH2_D (in), PH2_U (in), PH3 (out), PH3_D (in), PH3_U (in), SHUNT1+ (out), V_Motor (bidir)

### Nets
GND_IRFS: R79.1 R86.1 ; port GND_IRFS
H1L: Q2.3(S) Q4.3(S) Q6.3(S) R73.2 R76.1 R79.2 R82.2 R86.2 ; port H1L, port SHUNT1+, port H2L, port H3L
PH1: BLDC1.1 Q1.3(S) Q2.2(D) R74.2 ; port PH1
PH1_D: R71.1 ; port PH1_D
PH1_U: R72.1 ; port PH1_U
PH2: BLDC1.2 Q3.3(S) Q4.2(D) R78.2 ; port PH2
PH2_D: R75.1 ; port PH2_D
PH2_U: R77.1 ; port PH2_U
PH3: BLDC1.3 Q5.3(S) Q6.2(D) R83.2 ; port PH3
PH3_D: R80.1 ; port PH3_D
PH3_U: R81.1 ; port PH3_U
V_Motor: Q1.2(D) Q3.2(D) Q5.2(D) ; port V_Motor
NetQ1_1: Q1.1(G) R72.2 R74.1
NetQ2_1: Q2.1(G) R71.2 R73.1
NetQ3_1: Q3.1(G) R77.2 R78.1
NetQ4_1: Q4.1(G) R75.2 R76.2
NetQ5_1: Q5.1(G) R81.2 R83.1
NetQ6_1: Q6.1(G) R80.2 R82.1

### Channels
DR1/IRFS_Bridges: designators BLDC1=BLDC1_DR1_IRFS_Bridges Q1=Q1 Q2=Q2 Q3=Q3 Q4=Q4 Q5=Q5 Q6=Q6 R71=R71 R72=R72 R73=R73 R74=R74 R75=R75 R76=R76 R77=R77 R78=R78 R79=R79 R80=R80 R81=R81 R82=R82 R83=R83 R86=R86; ports GND_IRFS=GND_STM H1L=NetQ2_3 H2L=NetQ2_3 H3L=NetQ2_3 PH1=NetBLDC1_DR1_IRFS_Bridges_1 PH1_D=NetR71_1 PH1_U=NetR72_1 PH2=NetBLDC1_DR1_IRFS_Bridges_2 PH2_D=NetR75_1 PH2_U=NetR77_1 PH3=NetBLDC1_DR1_IRFS_Bridges_3 PH3_D=NetR80_1 PH3_U=NetR81_1 SHUNT1+=NetQ2_3 V_Motor=V_Motor
DR2/IRFS_Bridges: designators end in _DR2_IRFS_Bridges; ports GND_IRFS=GND_STM H1L=NetQ2_DR2_IRFS_Bridges_3 H2L=NetQ2_DR2_IRFS_Bridges_3 H3L=NetQ2_DR2_IRFS_Bridges_3 PH1=NetBLDC1_DR2_IRFS_Bridges_1 PH1_D=NetR71_DR2_IRFS_Bridges_1 PH1_U=NetR72_DR2_IRFS_Bridges_1 PH2=NetBLDC1_DR2_IRFS_Bridges_2 PH2_D=NetR75_DR2_IRFS_Bridges_1 PH2_U=NetR77_DR2_IRFS_Bridges_1 PH3=NetBLDC1_DR2_IRFS_Bridges_3 PH3_D=NetR80_DR2_IRFS_Bridges_1 PH3_U=NetR81_DR2_IRFS_Bridges_1 SHUNT1+=NetQ2_DR2_IRFS_Bridges_3 V_Motor=V_Motor

### Library data of the parts
BLDC1 = Terminal3: Connector; Value: ?
R71-R83 R86 = Res: Supplier 1: Digi-Key
  R71 R72 R75 R77 R80 R81: Value: 4.7; Supplier Part Number 1: 311-4.7GRCT-ND
  R73 R74 R76 R78 R82 R83: Value: 39K; Supplier Part Number 1: 311-39.0KHRDKR-ND
  R79 R86: Value: 0.001; Supplier Part Number 1: WSLPD-.001CT-ND
Q1-Q6 = IRFS7530: Supplier 1: Digi-Key; Supplier Part Number 1: IRFS7530-7PPBF-ND

## Nets that join several sheets
3V3_IRFS: DR1 (10 pins), DR2 (10 pins)
3V3_STM: Sheet_STM32_Microcontroller (15 pins), Sheet_FT4232_USB (18 pins)
5V_IRFS: Sheet_Ninja_ECU (R95.2 R96.2 R97.2 R98.2), Sheet_STM32_Microcontroller (21 pins), Sheet_FT4232_USB (H20.2), DR1 (13 pins), DR2 (13 pins)
GND_STM: Sheet_Ninja_ECU (6 pins), Sheet_STM32_Microcontroller (63 pins), Sheet_FT4232_USB (38 pins), DR1 (47 pins), DR1/IRFS_Bridges (R79.1 R86.1), DR2 (47 pins), DR2/IRFS_Bridges (R79_DR2_IRFS_Bridges.1 R86_DR2_IRFS_Bridges.1)
PVDD1: DR1 (7 pins), DR2 (7 pins)
PVDD2: DR1 (8 pins), DR2 (8 pins)
V_BATT: DR1 (7 pins), DR2 (7 pins)
V_Motor: Sheet_Ninja_ECU (C28#1.2 C31#1.2 PWR1.2 PWR2.2), Sheet_STM32_Microcontroller (C18.2 R7.2 R38.1 U4.1), DR1 (C28#2.2 C31#2.2 L3.1), DR1/IRFS_Bridges (Q1.2 Q3.2 Q5.2), DR2 (C28_DR2.2 C31_DR2.2 L3_DR2.1), DR2/IRFS_Bridges (Q1_DR2_IRFS_Bridges.2 Q3_DR2_IRFS_Bridges.2 Q5_DR2_IRFS_Bridges.2)
NetBLDC1_DR1_IRFS_Bridges_1: DR1 (C51.1 U2.46), DR1/IRFS_Bridges (BLDC1_DR1_IRFS_Bridges.1 Q1.3 Q2.2 R74.2)
NetBLDC1_DR1_IRFS_Bridges_2: DR1 (C53.1 U2.36), DR1/IRFS_Bridges (BLDC1_DR1_IRFS_Bridges.2 Q3.3 Q4.2 R78.2)
NetBLDC1_DR1_IRFS_Bridges_3: DR1 (C52.1 U2.41), DR1/IRFS_Bridges (BLDC1_DR1_IRFS_Bridges.3 Q5.3 Q6.2 R83.2)
NetBLDC1_DR2_IRFS_Bridges_1: DR2 (C51_DR2.1 U2_DR2.46), DR2/IRFS_Bridges (BLDC1_DR2_IRFS_Bridges.1 Q1_DR2_IRFS_Bridges.3 Q2_DR2_IRFS_Bridges.2 R74_DR2_IRFS_Bridges.2)
NetBLDC1_DR2_IRFS_Bridges_2: DR2 (C53_DR2.1 U2_DR2.36), DR2/IRFS_Bridges (BLDC1_DR2_IRFS_Bridges.2 Q3_DR2_IRFS_Bridges.3 Q4_DR2_IRFS_Bridges.2 R78_DR2_IRFS_Bridges.2)
NetBLDC1_DR2_IRFS_Bridges_3: DR2 (C52_DR2.1 U2_DR2.41), DR2/IRFS_Bridges (BLDC1_DR2_IRFS_Bridges.3 Q5_DR2_IRFS_Bridges.3 Q6_DR2_IRFS_Bridges.2 R83_DR2_IRFS_Bridges.2)
NetH21_5: Sheet_STM32_Microcontroller (R20.2 U1.51), Sheet_FT4232_USB (H21.5)
NetQ2_3: DR1 (R56.2 U2.34 U2.39 U2.44), DR1/IRFS_Bridges (8 pins)
NetQ2_DR2_IRFS_Bridges_3: DR2 (R56_DR2.2 U2_DR2.34 U2_DR2.39 U2_DR2.44), DR2/IRFS_Bridges (8 pins)
NetR71_1: DR1 (U2.45), DR1/IRFS_Bridges (R71.1)
NetR71_DR2_IRFS_Bridges_1: DR2 (U2_DR2.45), DR2/IRFS_Bridges (R71_DR2_IRFS_Bridges.1)
NetR72_1: DR1 (U2.47), DR1/IRFS_Bridges (R72.1)
NetR72_DR2_IRFS_Bridges_1: DR2 (U2_DR2.47), DR2/IRFS_Bridges (R72_DR2_IRFS_Bridges.1)
NetR75_1: DR1 (U2.35), DR1/IRFS_Bridges (R75.1)
NetR75_DR2_IRFS_Bridges_1: DR2 (U2_DR2.35), DR2/IRFS_Bridges (R75_DR2_IRFS_Bridges.1)
NetR77_1: DR1 (U2.37), DR1/IRFS_Bridges (R77.1)
NetR77_DR2_IRFS_Bridges_1: DR2 (U2_DR2.37), DR2/IRFS_Bridges (R77_DR2_IRFS_Bridges.1)
NetR80_1: DR1 (U2.40), DR1/IRFS_Bridges (R80.1)
NetR80_DR2_IRFS_Bridges_1: DR2 (U2_DR2.40), DR2/IRFS_Bridges (R80_DR2_IRFS_Bridges.1)
NetR81_1: DR1 (U2.42), DR1/IRFS_Bridges (R81.1)
NetR81_DR2_IRFS_Bridges_1: DR2 (U2_DR2.42), DR2/IRFS_Bridges (R81_DR2_IRFS_Bridges.1)
NetU1_47: Sheet_STM32_Microcontroller (U1.47), Sheet_FT4232_USB (U7.17)
NetU1_48: Sheet_STM32_Microcontroller (U1.48), Sheet_FT4232_USB (U7.16)